# EAGLE design astable mul (EAGLE 7.5.0)
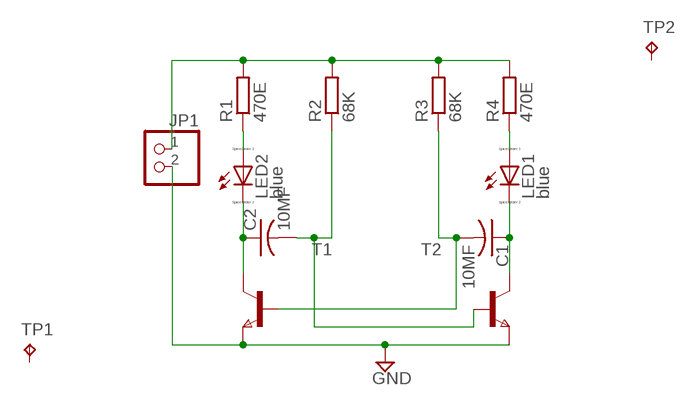
[diagram p0: schematic, sheet 1]

## Parts
C1  10MF  C-US050-025X075  [C050-025X075]
C2  10MF  C-US050-025X075  [C050-025X075]
JP1  PINHD-1X2  [1X02]
LED1  blue  LED_E  [LED_1206]
LED2  blue  LED_E  [LED_1206]
R1  470E  R-EU_R0805  [R0805]
R2  68K  R-EU_R0805  [R0805]
R3  68K  R-EU_R0805  [R0805]
R4  470E  R-EU_R0805  [R0805]
T1  NPNSOT23  [SOT-23]
T2  NPNSOT23  [SOT-23]
TP1  TPB1,27  [B1,27]
TP2  TPB1,27  [B1,27]

## Nets
GND: JP1.2 T1.2(E) T2.2(E)
N$1: JP1.1 R1.2 R2.2 R3.2 R4.2
N$2: LED2.A R1.1
N$3: C2.1 LED2.C T1.1(C)
N$4: LED1.A R4.1
N$5: C1.1 LED1.C T2.1(C)
N$7: C2.2 R2.1 T2.3(B)
N$8: C1.2 R3.1 T1.3(B)
Unconnected: TP1.TP TP2.TP

## Library data of the parts
C1 C2 = rcl:C-US: CAPACITOR, American symbol
JP1 = pinhead:PINHD-1X2: PIN HEADER
LED1 LED2 = eagle-ltspice:LED_E: LED Source: http://www.osram.convergy.de Source: www.luxeon.com Source: www.kingbright.com; SPICEMODEL: NONE; SPICEPREFIX: D; SPICETYPE: diode
R1-R4 = rcl:R-EU_: RESISTOR, European symbol
T1 T2 = zetex:NPNSOT23: NPN TRANSISTOR; MPN: DSS20201L-7; OC_FARNELL: 1710688; OC_NEWARK: 25R4555
TP1 TP2 = testpad:TP: Test pad

## Board
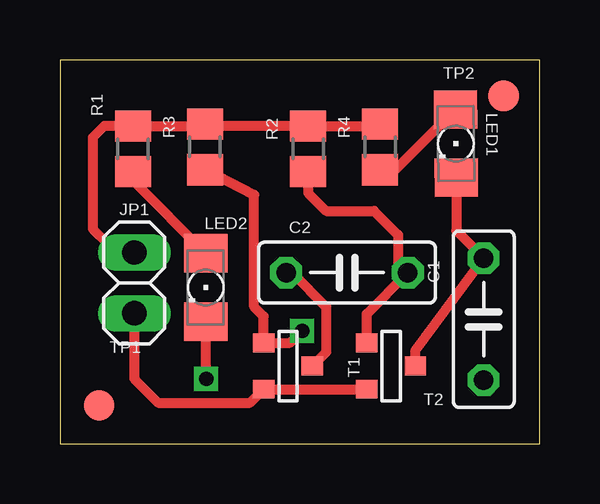
[diagram p1: board, top side]
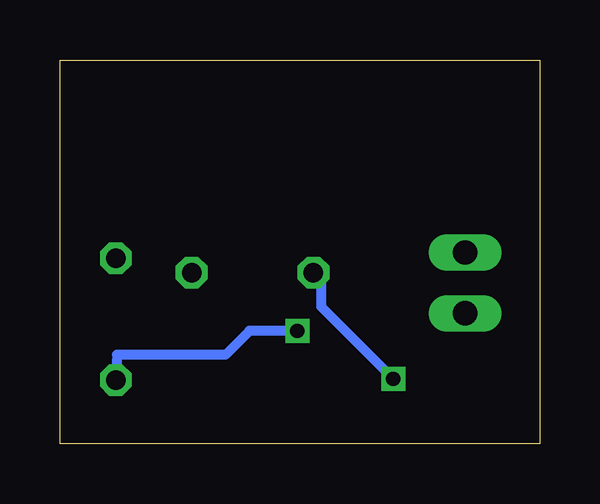
[diagram p2: board, bottom side, seen from below]

Size 20 x 16 mm. Coordinates in mm from the lower left corner, seen from the top.
Outline: 0,0 20,0 20,16 0,16 0,0
Copper layers (1*16): Top 0.035mm / dielectric 1.5mm / Bottom 0.035mm
Design rules "default": minimum track width 10mil, minimum drill 24mil, track to track 8mil, track to pad 8mil, pad to pad 8mil, via to via 8mil, smd to smd 8mil, copper to edge 40mil, drill to drill 8mil, minimum pad ring 10mil, minimum via ring 8mil, stop-mask expansion 4mil, vias tented up to drill 0mil, thermal gap 10mil

### Footprints (pad centres in the part's own frame; a part is rotated, then mirrored left to right if it is on the bottom)
C050-025X075 = drill 0.813 octagon: 1 -2.54,0; 2 2.54,0
1X02 = drill 1.016 long: 1 -1.27,0; 2 1.27,0
LED_1206 = smd 1.6 x 1.803: A -1.422,0; C 1.422,0
R0805 = smd 1.3 x 1.5: 1 -0.95,0; 2 0.95,0
SOT-23 = smd 0.787 x 0.889: 1 0.025,-1.016; 2 -0.94,1.016; 3 0.991,1.016
B1,27 = smd 1.27 x 1.27: TP 0,0

### Placement (x,y rotation side)
C1  17.67,5.19 270 top
C2  11.97,7.13 0 top
JP1  3.1,6.7 270 top
LED1  16.51,12.51 270.5 top
LED2  6.08,6.51 270 top
R1  3.05,12.29 90 top
R2  10.35,12.29 90 top
R3  6.05,12.37 90 top
R4  13.35,12.37 90 top
T1  9.51,3.21 90 top
T2  13.81,3.21 90 top
TP1  1.64,1.6 0 top
TP2  18.5,14.5 90 top

### Tracks (layer width: path | path; a pad name or v marks a point on that pad's centre or on a via)
GND
  Top 0.406: JP1.2 3.1,2.7 4.1,1.7 7.92,1.7 T1.2 T2.2
N$1
  Top 0.406: R4.2 13.27,13.24 R2.2 6.13,13.24 R3.2 5.97,13.24 R1.2 1.84,13.24 1.37,12.77 1.37,8.96 2,8.32 2.75,8.32 JP1.1
N$2
  Top 0.406: R1.1 3.05,10.96 LED2.A
N$3  (via drill 0.6)
  Top 0.406: C2.1 9.67,7.13 11.1,5.7 11.1,3.81 T1.1 | LED2.C 6.08,3.72 v6.1,2.7
  Bottom 0.406: v6.1,2.7 9.1,5.7 9.1,6.8 C2.1
N$4
  Top 0.406: R4.1 13.99,11.42 LED1.A
N$5
  Top 0.406: T2.1 14.83,3.89 C1.1 16.52,8.88 LED1.C
N$7
  Top 0.406: T2.3 12.79,5.41 C2.2 14.1,7.54 14.1,8.7 13.1,9.7 11.1,9.7 10.35,10.45 R2.1
N$8  (via drill 0.6)
  Top 0.406: R3.1 8.1,10.37 8.1,5.7 8.49,5.31 T1.3 9.6,4.2 v10.1,4.7
  Bottom 0.406: v10.1,4.7 12.1,4.7 13.1,3.7 17.62,3.7 C1.2